# EAGLE design Keyglove Kit v0.1 (EAGLE 6.1)
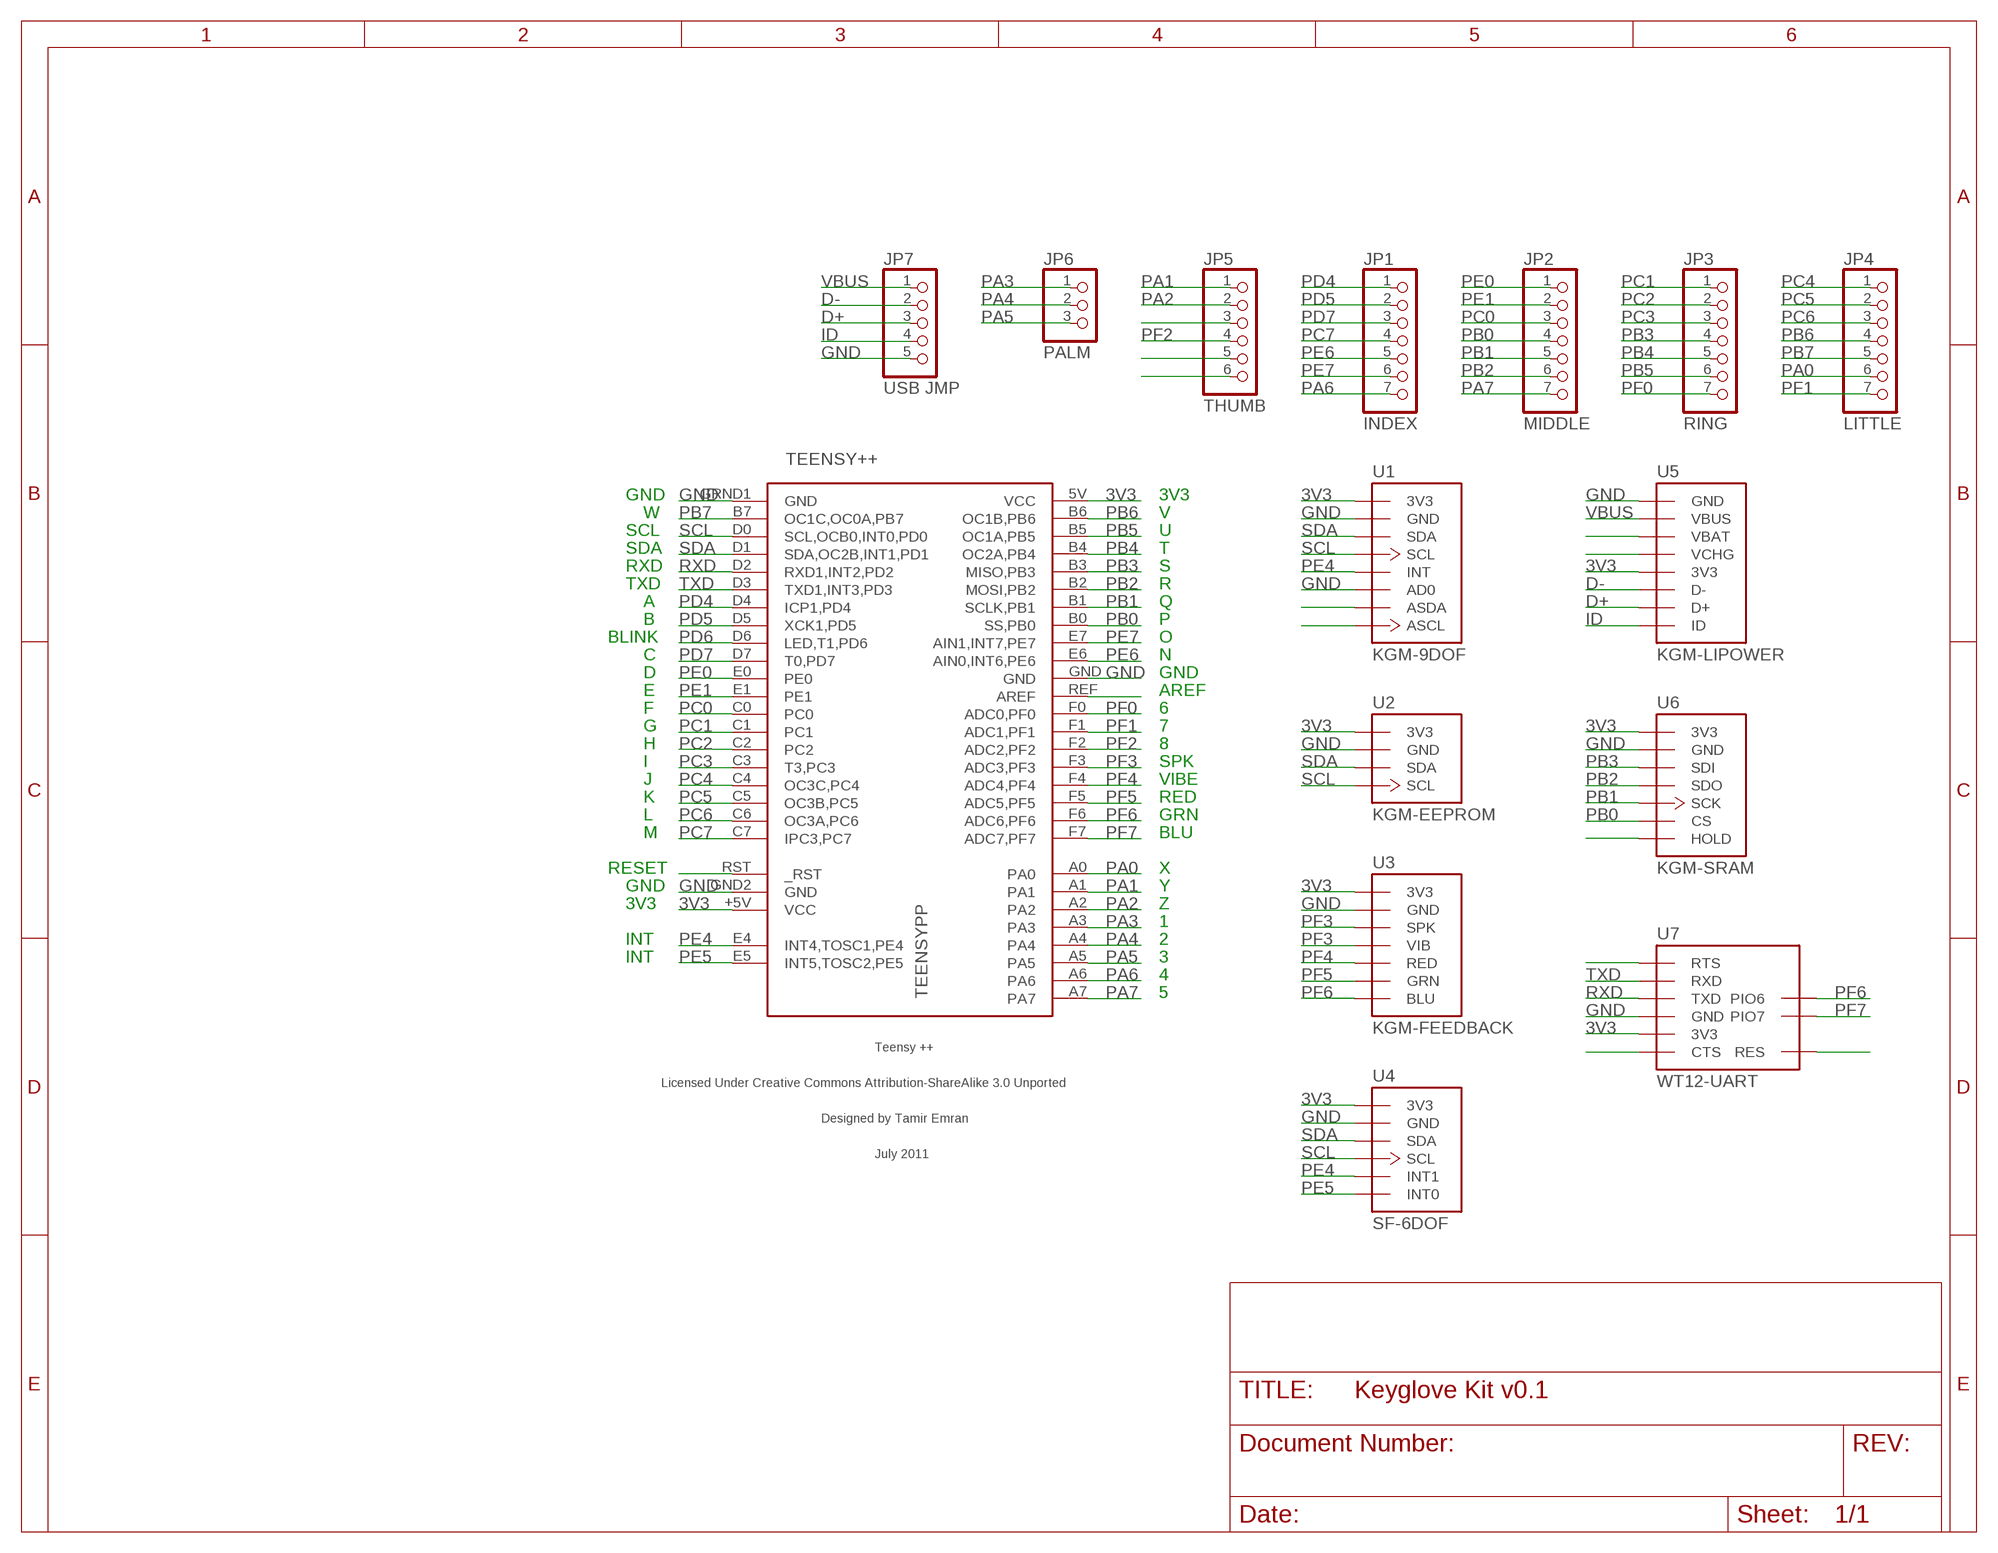
[diagram p0: schematic, sheet 1]

## Parts
JP1  INDEX  PINHD-1X7  [1X07]
JP2  MIDDLE  PINHD-1X7  [1X07]
JP3  RING  PINHD-1X7  [1X07]
JP4  LITTLE  PINHD-1X7  [1X07]
JP5  THUMB  PINHD-1X6  [1X06]
JP6  PALM  PINHD-1X3  [1X03]
JP7  USB JMP  PINHD-1X5  [1X05]
TEENSY++  TEENSYPP  [TEENSYPP]
U1  KGM-9DOF  [KGM-9DOF]
U2  KGM-EEPROM  [KGM-EEPROM]
U3  KGM-FEEDBACK  [KGM-FEEDBACK]
U4  SF-6DOF  [SF-6DOF]
U5  KGM-LIPOWER  [KGM-LIPOWER]
U6  KGM-SRAM  [KGM-SRAM]
U7  WT12-UART  [WT12-UART]

## Nets
3V3 [power]: TEENSY++.5V(VCC) TEENSY++.+5V(VCC) U1.3V3 U2.3V3 U3.3V3 U4.3V3 U5.3V3 U6.3V3 U7.3V3
D+: JP7.3 U5.D+
D-: JP7.2 U5.D-
GND [power]: JP7.5 TEENSY++.GND TEENSY++.GND2(GND) TEENSY++.GRND1(GND) U1.AD0 U1.GND U2.GND U3.GND U4.GND U5.GND U6.GND U7.GND
ID: JP7.4 U5.ID
N$3: U7.RESET(RES)
N$13: JP5.3
N$15: JP5.5
N$16: JP5.6
N$51: U1.ASDA
N$52: U1.ASCL
N$66: U5.VBAT
N$67: U5.VCHG
N$78: U6.HOLD
N$79: U7.RTS
N$80: U7.CTS
N$107: TEENSY++.RST(_RST)
N$128: TEENSY++.REF(AREF)
PA0: JP4.6 TEENSY++.A0
PA1: JP5.1 TEENSY++.A1
PA2: JP5.2 TEENSY++.A2
PA3: JP6.1 TEENSY++.A3
PA4: JP6.2 TEENSY++.A4
PA5: JP6.3 TEENSY++.A5
PA6: JP1.7 TEENSY++.A6
PA7: JP2.7 TEENSY++.A7
PB0: JP2.4 TEENSY++.B0(SS,PB0) U6.CS
PB1: JP2.5 TEENSY++.B1(SCLK,PB1) U6.SCK
PB2: JP2.6 TEENSY++.B2(MOSI,PB2) U6.SDO
PB3: JP3.4 TEENSY++.B3(MISO,PB3) U6.SDI
PB4: JP3.5 TEENSY++.B4(OC2A,PB4)
PB5: JP3.6 TEENSY++.B5(OC1A,PB5)
PB6: JP4.4 TEENSY++.B6(OC1B,PB6)
PB7: JP4.5 TEENSY++.B7(OC1C,OC0A,PB7)
PC0: JP2.3 TEENSY++.C0
PC1: JP3.1 TEENSY++.C1
PC2: JP3.2 TEENSY++.C2
PC3: JP3.3 TEENSY++.C3(T3,PC3)
PC4: JP4.1 TEENSY++.C4(OC3C,PC4)
PC5: JP4.2 TEENSY++.C5(OC3B,PC5)
PC6: JP4.3 TEENSY++.C6(OC3A,PC6)
PC7: JP1.4 TEENSY++.C7(IPC3,PC7)
PD4: JP1.1 TEENSY++.D4(ICP1,PD4)
PD5: JP1.2 TEENSY++.D5(XCK1,PD5)
PD6: TEENSY++.D6(LED,T1,PD6)
PD7: JP1.3 TEENSY++.D7(T0,PD7)
PE0: JP2.1 TEENSY++.E0
PE1: JP2.2 TEENSY++.E1
PE4: TEENSY++.E4(INT4,TOSC1,PE4) U1.INT U4.INT1
PE5: TEENSY++.E5(INT5,TOSC2,PE5) U4.INT0
PE6: JP1.5 TEENSY++.E6(AIN0,INT6,PE6)
PE7: JP1.6 TEENSY++.E7(AIN1,INT7,PE7)
PF0: JP3.7 TEENSY++.F0(ADC0,PF0)
PF1: JP4.7 TEENSY++.F1(ADC1,PF1)
PF2: JP5.4 TEENSY++.F2(ADC2,PF2)
PF3: TEENSY++.F3(ADC3,PF3) U3.SPK U3.VIB
PF4: TEENSY++.F4(ADC4,PF4) U3.RED
PF5: TEENSY++.F5(ADC5,PF5) U3.GRN
PF6: TEENSY++.F6(ADC6,PF6) U3.BLUE(BLU) U7.PIO6
PF7: TEENSY++.F7(ADC7,PF7) U7.PIO7
RXD: TEENSY++.D2(RXD1,INT2,PD2) U7.TXD
SCL: TEENSY++.D0(SCL,OCB0,INT0,PD0) U1.SCL U2.SCL U4.SCL
SDA: TEENSY++.D1(SDA,OC2B,INT1,PD1) U1.SDA U2.SDA U4.SDA
TXD: TEENSY++.D3(TXD1,INT3,PD3) U7.RXD
VBUS [power]: JP7.1 U5.VBUS

## Notes on the sheet
- GND | 3V3
- W | V
- SCL | U
- SDA | T
- RXD | S
- TXD | R
- A | Q
- B | P
- BLINK | O
- C | N
- D | GND
- E | AREF
- F | 6
- G | 7
- H | 8
- I | SPK
- J | VIBE
- K | RED
- L | GRN
- M | BLU
- RESET | X
- GND | Y
- 3V3 | Z
- 1
- INT | 2
- INT | 3
- 4
- 5

## Library data of the parts
JP1-JP4 = sf-pinhead:PINHD-1X7: PIN HEADER
JP5 = sf-pinhead:PINHD-1X6: PIN HEADER
JP6 = sf-pinhead:PINHD-1X3: PIN HEADER
JP7 = sf-pinhead:PINHD-1X5: PIN HEADER
TEENSY++ = sf-keyglovekit:TEENSYPP: Teensy++ Teensy++ board by PJRC <http://www.pjrc.com/>. Eagle part designed by Tamir Emran, July 2011. Licensed under Create Commons Attribution-ShareAlike 3.0 Unported license (CC-BY-SA-3.0).
U1 = sf-keyglovekit:KGM-9DOF
U2 = sf-keyglovekit:KGM-EEPROM
U3 = sf-keyglovekit:KGM-FEEDBACK
U4 = sf-keyglovekit:SF-6DOF
U5 = sf-keyglovekit:KGM-LIPOWER
U6 = sf-keyglovekit:KGM-SRAM
U7 = sf-keyglovekit:WT12-UART

## Net classes
0 default: width 0.152 mm, drill 0.33 mm, clearance 0.152 mm
1 power: width 0.203 mm, drill 0.33 mm, clearance 0.152 mm

## Board
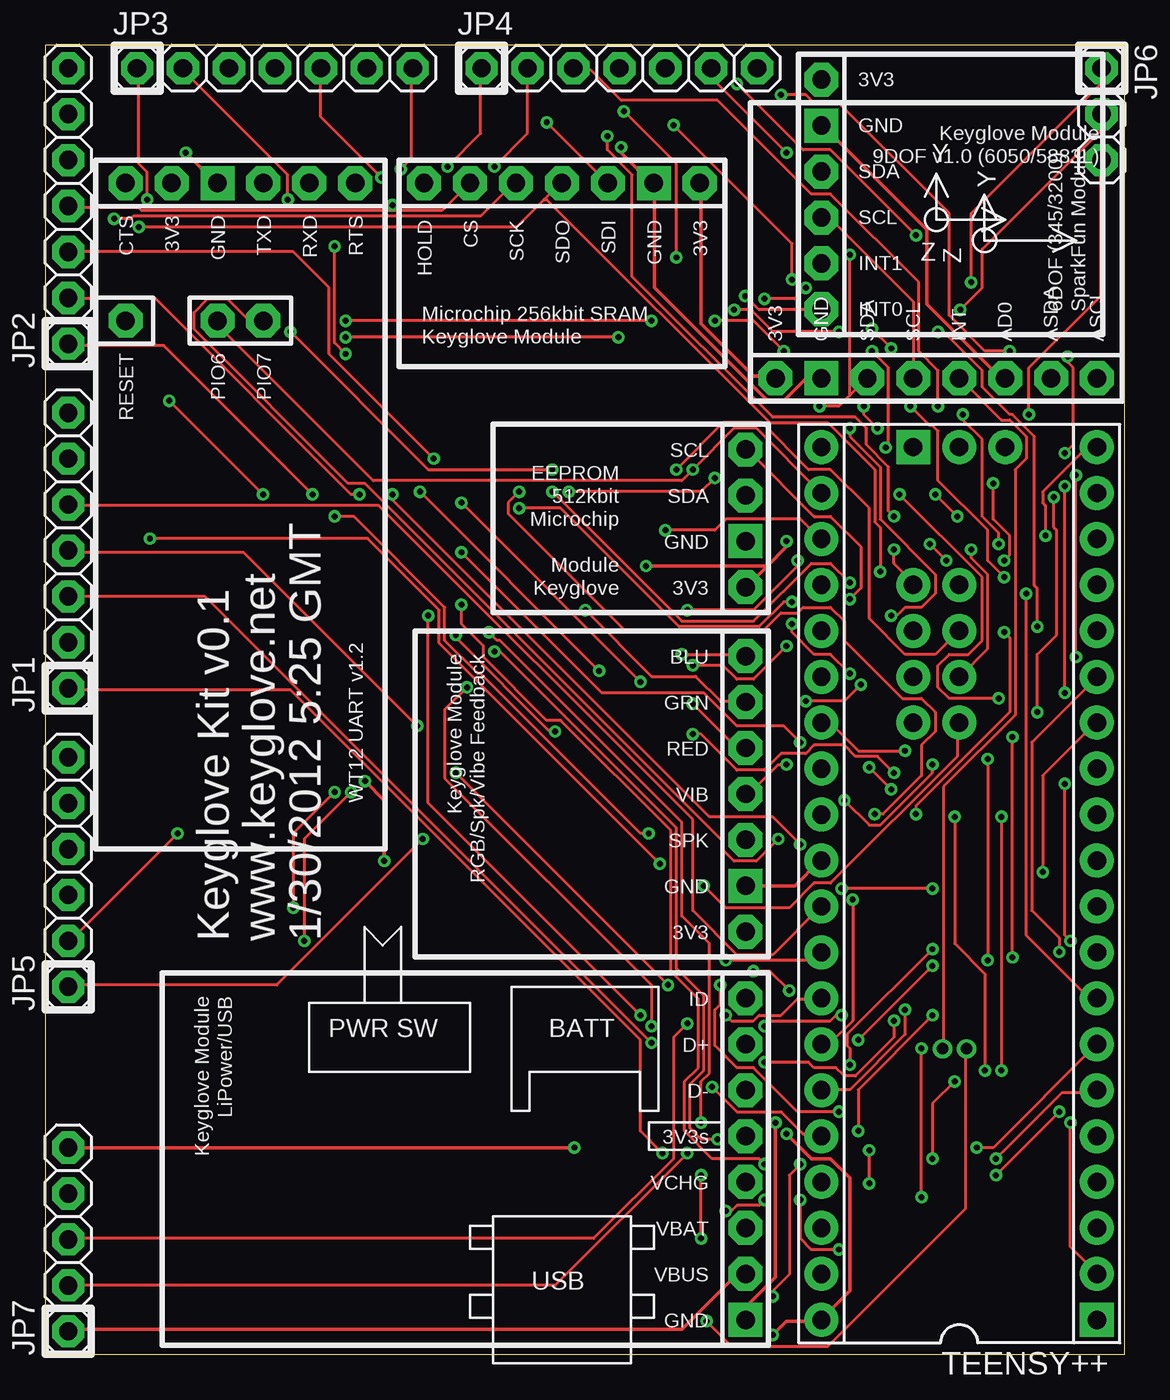
[diagram p1: board, top side]
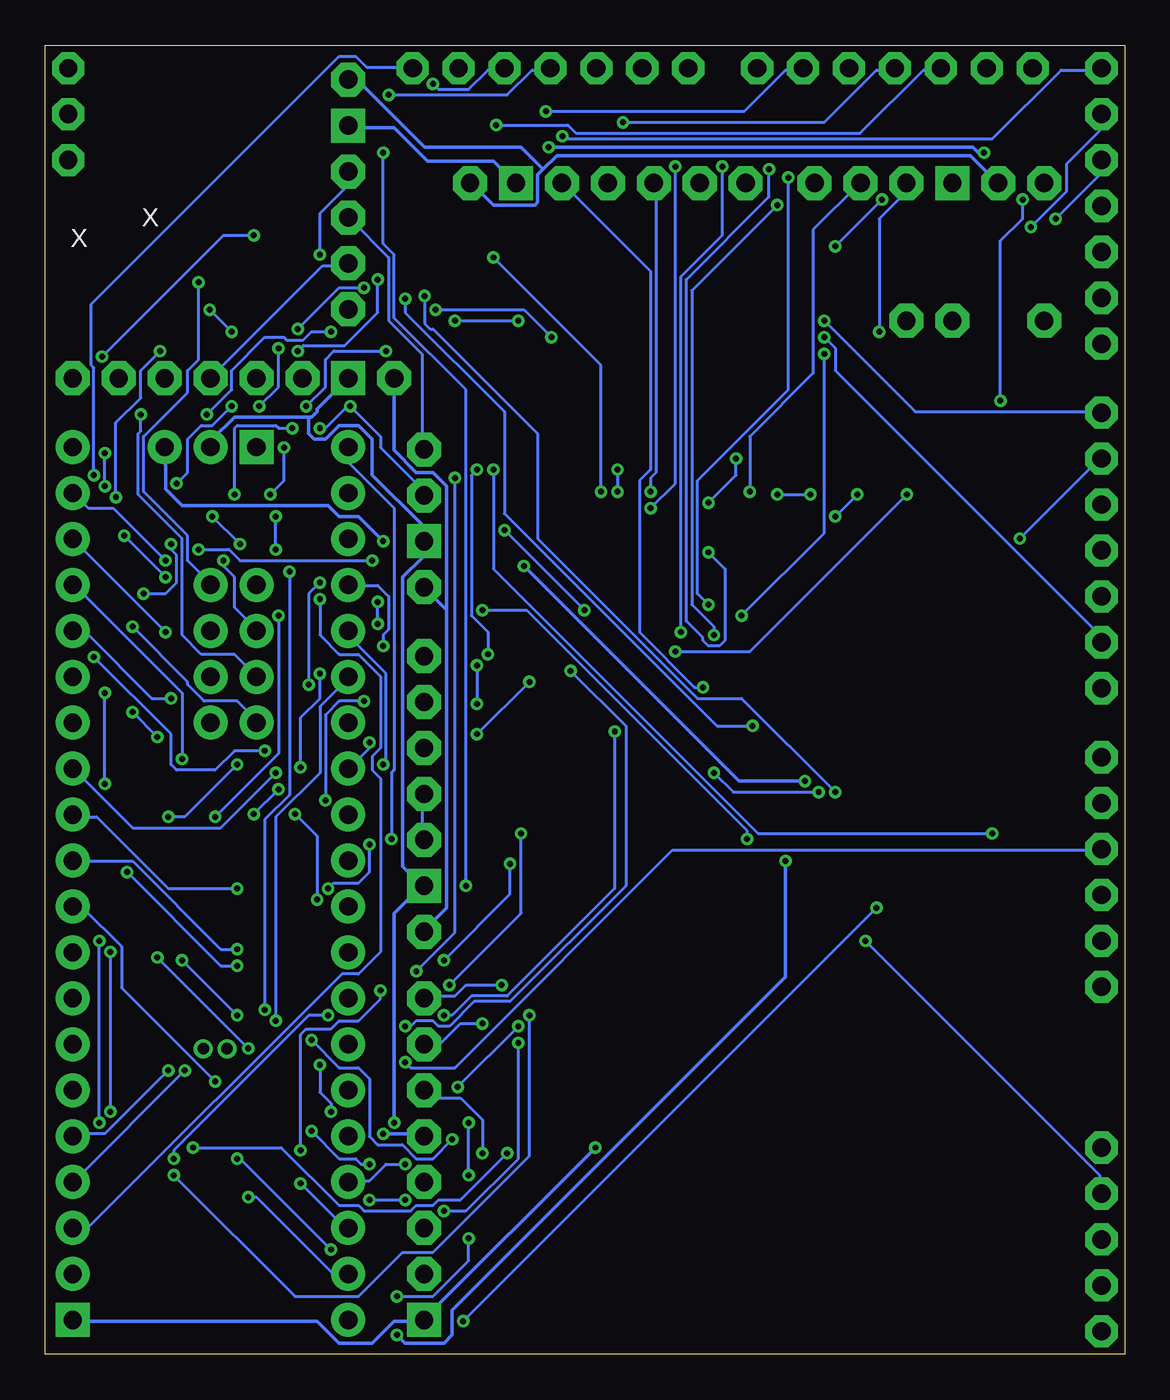
[diagram p2: board, bottom side, seen from below]

Size 59.69 x 72.39 mm. Coordinates in mm from the lower left corner, seen from the top.
Outline: 0,0 59.69,0 59.69,72.39 0,72.39 0,0
Copper layers (1*16): Top 0.0356mm / dielectric 1.5011mm / Bottom 0.0356mm
Design rules: minimum track width 6mil, minimum drill 13mil, track to track 6mil, track to pad 6mil, pad to pad 6mil, via to via 6mil, smd to smd 6mil, copper to edge 15mil, drill to drill 6mil, minimum pad ring 7mil, minimum via ring 7mil, stop-mask expansion 4mil, vias tented up to drill 20mil, thermal gap 10mil

### Footprints (pad centres in the part's own frame; a part is rotated, then mirrored left to right if it is on the bottom)
1X07 = drill 1.016 pad 1.778 octagon: 1 -7.62,0; 2 -5.08,0; 3 -2.54,0; 4 0,0; 5 2.54,0; 6 5.08,0; 7 7.62,0
1X06 = drill 1.016 pad 1.778 octagon: 1 -6.35,0; 2 -3.81,0; 3 -1.27,0; 4 1.27,0; 5 3.81,0; 6 6.35,0
1X03 = drill 1.016 pad 1.778 octagon: 1 -2.54,0; 2 0,0; 3 2.54,0
1X05 = drill 1.016 pad 1.778 octagon: 1 -5.08,0; 2 -2.54,0; 3 0,0; 4 2.54,0; 5 5.08,0
TEENSYPP = drill 1.016 pad 1.88: 5V 24.13,-2.54; +5V -24.13,7.62; A0 8.89,0; A1 11.43,0; A2 13.97,0; A3 16.51,0; A4 8.89,2.54; A5 11.43,2.54; A6 13.97,2.54; A7 16.51,2.54; B0 -6.35,7.62; B1 -8.89,7.62; B2 -11.43,7.62; B3 -13.97,7.62; B4 -16.51,7.62; B5 -19.05,7.62; B6 -21.59,7.62; B7 -21.59,-7.62; C0 6.35,-7.62; C1 8.89,-7.62; C2 11.43,-7.62; C3 13.97,-7.62; C4 16.51,-7.62; C5 19.05,-7.62; C6 21.59,-7.62; C7 24.13,-7.62; D0 -19.05,-7.62; D1 -16.51,-7.62; D2 -13.97,-7.62; D3 -11.43,-7.62; D4 -8.89,-7.62; D5 -6.35,-7.62; D6 -3.81,-7.62; D7 -1.27,-7.62; E0 1.27,-7.62; E1 3.81,-7.62; E6 -1.27,7.62; E7 -3.81,7.62; F0 6.35,7.62; F1 8.89,7.62; F2 11.43,7.62; F3 13.97,7.62; F4 16.51,7.62; F5 19.05,7.62; F6 21.59,7.62; F7 24.13,7.62; GND2 24.13,0; GRND1 1.27,7.62; REF 3.81,7.62 | drill 0.635 pad 1.067: E4 -9.144,0.914; E5 -9.144,-0.406 | drill 1.016 pad 1.88 square: GND -24.13,-7.62; RST 24.13,2.54
KGM-9DOF = drill 1.016 pad 1.88 octagon: 3V3 1.27,19.177; AD0 1.27,6.477; ASCL 1.27,1.397; ASDA 1.27,3.937; INT 1.27,9.017; SCL 1.27,11.557; SDA 1.27,14.097 | drill 1.016 pad 1.88 square: GND 1.27,16.637
KGM-EEPROM = drill 1.016 pad 1.88 octagon: 3V3 1.27,9.017; SCL 1.27,1.397; SDA 1.27,3.937 | drill 1.016 pad 1.88 square: GND 1.27,6.477
KGM-FEEDBACK = drill 1.016 pad 1.88 octagon: 3V3 1.27,16.637; BLUE 1.27,1.397; GRN 1.27,3.937; RED 1.27,6.477; SPK 1.27,11.557; VIB 1.27,9.017 | drill 1.016 pad 1.88 square: GND 1.27,14.097
SF-6DOF = drill 1.016 pad 1.88 octagon: 3V3 1.27,14.097; INT0 1.27,1.397; INT1 1.27,3.937; SCL 1.27,6.477; SDA 1.27,9.017 | drill 1.016 pad 1.88 square: GND 1.27,11.557
KGM-LIPOWER = drill 1.016 pad 1.88 octagon: 3V3 1.27,9.017; D+ 1.27,3.937; D- 1.27,6.477; ID 1.27,1.397; VBAT 1.27,14.097; VBUS 1.27,16.637; VCHG 1.27,11.557 | drill 1.016 pad 1.88 square: GND 1.27,19.177
KGM-SRAM = drill 1.016 pad 1.88 octagon: 3V3 1.27,16.637; CS 1.27,3.937; HOLD 1.27,1.397; SCK 1.27,6.477; SDI 1.27,11.557; SDO 1.27,9.017 | drill 1.016 pad 1.88 square: GND 1.27,14.097
WT12-UART = drill 1.016 pad 1.88 octagon: 3V3 1.27,4.191; CTS 1.27,1.651; PIO6 8.89,6.731; PIO7 8.89,9.271; RESET 8.89,1.651; RTS 1.27,14.351; RXD 1.27,11.811; TXD 1.27,9.271 | drill 1.016 pad 1.88 square: GND 1.27,6.731

### Placement (x,y rotation side)
JP1  1.27,44.45 90 top
JP2  1.27,63.5 90 top
JP3  12.7,71.12 0 top
JP4  31.75,71.12 0 top
JP5  1.27,26.67 90 top
JP6  58.42,68.58 270 top
JP7  1.27,6.35 90 top
TEENSY++  50.55,26.04 90 top
U1  59.56,52.7 90 top
U2  40.01,51.44 180 top
U3  40.01,40.01 180 top
U4  41.66,56.39 0 top
U5  40.01,21.08 180 top
U6  19.56,66.04 270 top
U7  2.79,66.04 270 top

### Tracks (layer width: path | path; a pad name or v marks a point on that pad's centre or on a via)
3V3  (via drill 0.33)
  Top 0.203: U1.3V3 40.39,54.1 39.17,54.1 36.27,57 36.27,64.77 U6.3V3 | v41,12.19 42.37,10.82 43.43,10.82 44.5,9.75 44.5,3.5 42.98,1.98 TEENSY++.+5V 42.82,1.83 41,1.83 v40.23,1.07 | v41,44.96 41,44.65 39.93,43.59 | 39.93,43.59 38.86,42.52 U2.3V3 | v18.75,27.28 18.75,30.63 v17.68,31.7 | 39.93,43.59 v33.22,43.59
  Bottom 0.203: 32.16,65.53 32.46,65.23 32.46,63.7 32.61,63.55 34.9,63.55 36.12,64.77 U6.3V3 | 32.16,65.53 31.39,66.29 8.53,66.29 7.01,64.77 U7.3V3 | 32.16,65.53 33.38,66.75 38.71,66.75 42.37,70.41 42.82,70.41 U4.3V3 | v41,12.19 38.86,12.19 U5.3V3 | 37.49,41.15 37.49,24.69 38.71,23.47 U3.3V3 | 37.49,41.15 38.71,42.37 U2.3V3 | v41,44.96 42.37,46.33 43.43,46.33 44.04,46.94 52.12,46.94 53.03,47.85 53.03,50.14 TEENSY++.5V | v40.23,1.07 39.78,0.61 37.64,0.61 37.19,1.07 37.19,2.44 18.75,20.88 v18.75,27.28 | v17.68,31.7 21.34,31.7 v33.22,43.59 | U1.3V3 40.39,49.99 39.17,48.77 38.25,48.77 37.49,48.01 37.49,41.15
D+  (via drill 0.33)
  Top 0.152: v35.51,18.29 34.75,17.53 34.75,10.82 30.33,6.4 1.37,6.4 JP7.3
  Bottom 0.152: v35.51,18.29 36.73,18.29 37.8,17.22 38.71,17.22 U5.D+
D-  (via drill 0.33)
  Top 0.152: JP7.2 28.19,3.81 v35.51,11.12
  Bottom 0.152: v35.51,11.12 35.51,12.95 36.73,14.17 38.41,14.17 38.71,14.48 U5.D-
GND  (via drill 0.33)
  Top 0.203: v29.26,11.43 JP7.5 | U1.AD0 53.03,54.1 52.73,54.1 48.77,58.06 48.77,62.18 42.98,67.97 U4.GND | U3.GND 41.45,25.91 42.82,27.28 TEENSY++.GRND1 | v7.77,66.45 9.45,64.77 U7.GND | v31.85,66.75 31.85,66.45 33.53,64.77 U6.GND 33.68,64.77 33.68,58.98 39.93,52.73 40.84,52.73 42.06,53.95 42.82,53.95 U1.GND | v40.39,12.8 40.39,4.27 38.86,2.74 38.86,1.98 U5.GND
  Bottom 0.203: v29.26,11.43 38.71,1.98 U5.GND 38.86,1.83 40.39,1.83 41.6,0.61 43.43,0.61 44.65,1.83 58.06,1.83 TEENSY++.GND | 38.86,44.96 38.86,44.04 39.93,42.98 39.93,26.98 38.86,25.91 | 45.11,51.82 49.23,51.82 50.44,50.6 50.44,50.29 TEENSY++.GND2 | 45.11,51.82 44.96,51.82 44.65,52.12 44.65,52.27 42.98,53.95 U1.GND | v7.77,66.45 8.08,66.45 8.38,66.75 v31.85,66.75 | 38.86,44.96 38.86,45.87 41.6,48.62 41.6,50.6 42.37,51.36 43.43,51.36 44.2,50.6 44.81,50.6 45.11,50.9 45.11,51.82 | 38.86,44.96 U2.GND | U4.GND 42.82,67.82 40.39,67.82 38.56,65.99 34.9,65.99 33.68,64.77 U6.GND | v40.39,12.8 40.39,24.38 38.86,25.91 | 38.86,25.91 U3.GND
ID  (via drill 0.33)
  Top 0.152: v14.33,22.86 14.33,28.5 v16.92,31.09 | v34.44,20.42 v22.71,32.16
  Bottom 0.152: v14.33,22.86 1.37,9.91 1.37,8.99 JP7.4 | v16.92,31.09 21.64,31.09 v22.71,32.16 | v34.44,20.42 36.42,20.42 37.03,19.81 38.71,19.81 U5.ID
PA0  (via drill 0.33)
  Top 0.152: v41,66.45 36.88,70.56 36.88,71.02 JP4.6 | v36.42,25.91 37.64,24.69 41.15,24.69 42.52,26.06 43.43,26.06 50.44,33.07 50.44,34.9 TEENSY++.A0
  Bottom 0.152: v41,66.45 41,61.42 40.39,60.81 40.39,57.3 36.42,53.34 v36.42,25.91
PA1  (via drill 0.33)
  Top 0.152: v20.88,28.5 12.8,20.42 1.37,20.42 JP5.1 | v35.51,41.15 39.17,41.15 41.6,43.59 v41.6,43.89 | v51.21,44.5 51.21,44.04 52.12,43.13 52.12,39.01 50.6,37.49 TEENSY++.A1
  Bottom 0.152: v20.88,28.5 20.88,28.96 33.07,41.15 v35.51,41.15 | v41.6,43.89 48.92,43.89 49.53,44.5 v51.21,44.5
PA2  (via drill 0.33)
  Top 0.152: v7.32,28.8 1.37,22.86 JP5.2 | v34.9,48.92 37.49,51.51 39.62,51.51 42.22,48.92 43.43,48.92 45.57,46.79 45.57,40.69 47.55,38.71 49.23,38.71 50.44,39.93 TEENSY++.A2
  Bottom 0.152: v7.32,28.8 20.27,28.8 34.9,43.43 v34.9,48.92
PA3  (via drill 0.33)
  Top 0.152: v51.21,59.28 51.21,63.09 58.37,70.26 58.37,71.02 JP6.1
  Bottom 0.152: v51.21,59.28 51.21,55.02 51.82,54.41 51.82,53.19 54.25,50.75 54.25,47.7 51.82,45.26 51.82,43.89 50.6,42.67 TEENSY++.A3
PA4  (via drill 0.33)
  Top 0.152: v50.6,57.76 51.82,58.98 51.82,61.11 58.37,67.67 58.37,68.58 JP6.2 | v49.38,56.54 49.68,56.54 51.82,54.41 51.82,53.49 53.34,51.97 53.49,51.97 54.71,50.75 54.71,42.52 54.86,42.37 v54.86,40.23
  Bottom 0.152: v49.38,56.54 v50.6,57.76 | v54.86,40.23 51.82,37.19 51.82,37.03 50.9,36.12 49.07,36.12 48.01,35.05 TEENSY++.A4
PA5  (via drill 0.33)
  Top 0.152: v54.41,51.97 54.41,54.56 58.37,58.52 58.37,65.99 JP6.3
  Bottom 0.152: v54.41,51.97 54.41,51.05 54.56,50.9 54.56,47.55 52.12,45.11 52.12,39.78 51.05,38.71 49.23,38.71 48.01,37.49 TEENSY++.A5
PA6  (via drill 0.33)
  Top 0.152: v33.53,57.15 v16.61,57.15 | v37.03,57.15 39.17,57.15 v40.84,55.47 | v45.26,52.43 45.26,51.97 v46.02,51.21 | v50.44,46.33 v49.23,47.55 | v49.84,43.89 v48.92,44.81
  Bottom 0.152: v16.61,57.15 11.58,52.12 1.37,52.12 JP1.7 | v37.03,57.15 v33.53,57.15 | v40.84,55.47 43.74,55.47 44.2,55.02 44.2,53.49 v45.26,52.43 | v46.02,51.21 46.79,51.21 46.94,51.36 49.07,51.36 49.23,51.21 v49.23,47.55 | v48.92,44.81 v50.44,46.33 | v49.84,43.89 49.84,43.59 49.23,42.98 49.23,41.3 48.01,40.08 TEENSY++.A6
PA7  (via drill 0.33)
  Top 0.152: v31.09,67.36 31.09,66.6 32.46,65.23 32.46,59.59 40.23,51.82 44.81,51.82 45.41,51.21 45.41,50.29 46.63,49.07 46.63,46.63 v46.94,46.33 | v46.94,44.5 46.94,43.74 48.01,42.67 TEENSY++.A7
  Bottom 0.152: v31.09,67.36 30.94,67.21 7.32,67.21 3.5,71.02 1.37,71.02 JP2.7 | v46.94,44.5 v46.94,46.33
PB0  (via drill 0.33)
  Top 0.152: 19.2,63.25 21.95,63.25 23.47,64.77 U6.CS | 19.2,63.25 5.33,63.25 5.18,63.4 1.37,63.4 JP2.4 | v37.64,18.75 37.95,18.44 39.17,18.44 39.47,18.75 40.69,18.75 41.6,19.66 42.82,19.66 TEENSY++.B0 | v28.19,34.44 27.89,34.44 22.71,39.62 v22.71,39.78 | 19.2,63.25 v19.2,63.55
  Bottom 0.152: v37.64,18.75 37.19,18.75 36.12,19.81 34.14,19.81 28.19,25.76 v28.19,34.44 | v22.71,39.78 22.71,40.23 23.93,41.45 23.93,58.83 v19.2,63.55
PB1  (via drill 0.33)
  Top 0.152: v3.81,62.79 4.72,62.79 4.88,62.94 24.08,62.94 25.91,64.77 U6.SCK | v44.65,25.15 44.65,18.44 43.43,17.22 42.98,17.22 TEENSY++.B1 | v45.87,29.87 46.33,29.87 48.46,32 48.46,33.68 49.23,34.44 49.23,35.51 48.46,36.27 47.4,36.27 44.2,39.47 44.2,40.54 43.43,41.3 41.91,41.3 41.6,41 40.69,41 39.62,39.93 32.16,39.93 25.6,46.48 25.6,47.09 v26.21,47.7
  Bottom 0.152: v3.81,62.79 1.37,65.23 1.37,65.99 JP2.5 | v44.65,25.15 44.65,28.65 v45.87,29.87 | v26.21,47.7 26.21,48.46 25.91,48.77 25.91,64.77 U6.SCK
PB2  (via drill 0.33)
  Top 0.152: v5.18,62.33 26.06,62.33 27.58,63.86 | 27.58,63.86 28.5,64.77 U6.SDO | v47.55,19.05 47.55,17.68 44.5,14.63 42.98,14.63 TEENSY++.B2 | v46.18,43.28 46.18,45.72 45.87,46.02 45.87,48.92 43.28,51.51 40.08,51.51 27.74,63.86 27.58,63.86
  Bottom 0.152: v5.18,62.33 3.2,64.31 3.2,65.84 1.37,67.67 1.37,68.58 JP2.6 | v47.55,19.05 47.55,29.57 46.18,30.94 v46.18,43.28
PB3  (via drill 0.33)
  Top 0.152: v27.74,68.12 31.09,64.77 U6.SDI | v36.88,14.78 38.25,13.41 40.69,13.41 41.91,12.19 42.82,12.19 TEENSY++.B3 | v33.53,18.14 33.53,20.42 22.1,31.85 22.1,35.66 v23.32,36.88
  Bottom 0.152: v27.74,68.12 16.61,68.12 13.72,71.02 12.8,71.02 JP3.4 | v33.53,18.14 v36.88,14.78 | v23.32,36.88 23.77,36.88 26.82,39.93 26.82,48.31 26.21,48.92 26.21,59.89 31.09,64.77 U6.SDI
PB4  (via drill 0.33)
  Top 0.152: JP3.5 15.24,68.43 v18.59,65.08 | v23.01,41.45 23.01,40.39 24.23,39.17 24.23,38.56 27.74,35.05 28.5,35.05 34.59,28.96 34.59,21.18 36.12,19.66 36.12,15.85 35.36,15.09 35.36,12.34 36.88,10.82 39.47,10.82 v39.78,10.52
  Bottom 0.152: v18.59,65.08 18.59,53.34 23.62,48.31 23.62,42.06 v23.01,41.45 | v39.78,10.52 40.84,10.52 41.76,9.6 42.82,9.6 TEENSY++.B4
PB5  (via drill 0.33)
  Top 0.152: v32,68.73 34.9,65.84 v34.9,60.66 | v28.96,47.7 36.27,47.7 v37.03,48.46 | v39.17,21.18 40.08,21.18 v41.15,20.12 | v45.57,9.45 v45.57,11.28
  Bottom 0.152: v32,68.73 21.03,68.73 18.75,71.02 17.83,71.02 JP3.6 | v34.9,60.66 28.96,54.71 v28.96,47.7 | v37.03,48.46 37.03,23.32 v39.17,21.18 | v41.15,20.12 41.15,19.66 42.37,18.44 43.43,18.44 43.89,17.98 45.26,17.98 45.57,17.68 v45.57,11.28 | v45.57,9.45 42.98,6.86 TEENSY++.B5
PB6  (via drill 0.33)
  Top 0.152: v40.69,69.65 42.06,69.65 42.52,69.19 43.89,69.19 49.99,63.09 49.99,57.45 51.97,55.47 v53.34,55.47 | v55.78,47.4 55.78,45.72 55.93,45.57 55.93,39.78 54.86,38.71 v54.86,35.51 | v53.49,21.95 v53.49,34.14 | v48.46,8.69 v48.46,16.92
  Bottom 0.152: v40.69,69.65 34.14,69.65 32.77,71.02 31.85,71.02 JP4.4 | v53.34,55.47 54.41,54.41 54.41,52.88 55.78,51.51 v55.78,47.4 | v53.49,34.14 v54.86,35.51 | v48.46,16.92 v53.49,21.95 | v48.46,8.69 48.01,8.69 43.89,4.57 42.98,4.57 TEENSY++.B6
PB7  (via drill 0.33)
  Top 0.152: v38.25,70.26 41.91,66.6 43.43,66.6 v48.16,61.87 | v56.54,55.17 56.54,54.86 56.84,54.56 56.84,50.29 v56.39,49.84 | v56.39,36.58 v56.39,48.01 | v56.39,31.55 56.39,23.16 v56.69,22.86 | v56.69,12.8 56.69,5.94 58.06,4.57 TEENSY++.B7
  Bottom 0.152: v38.25,70.26 37.95,69.95 36.27,69.95 35.2,71.02 34.29,71.02 JP4.5 | v48.16,61.87 49.84,61.87 v56.54,55.17 | v56.39,48.01 v56.39,49.84 | v56.39,31.55 v56.39,36.58 | v56.69,12.8 v56.69,22.86
PC0  (via drill 0.33)
  Top 0.152: JP2.3 13.72,60.96 15.7,58.98 15.7,55.32 v21.49,49.53 | v32.92,37.19 v23.01,47.09 | v35.81,34.29 36.27,34.29 38.25,32.31 39.78,32.31 40.69,33.22 42.06,33.22 42.52,33.68 44.2,33.68 44.81,33.07 46.02,33.07 v46.94,32.16
  Bottom 0.152: v21.49,49.53 21.49,48.62 v23.01,47.09 | v35.81,34.29 v32.92,37.19 | v46.94,32.16 49.99,29.11 54.86,29.11 58.06,32.31 TEENSY++.C0
PC1  (via drill 0.33)
  Top 0.152: v5.64,63.86 5.64,65.38 5.18,65.84 5.18,71.02 JP3.1 | v12.04,47.55 v6.86,52.73 | v24.84,38.86 25.15,38.86 34.9,29.11 34.9,21.34 36.42,19.81 36.42,15.7 35.66,14.94 35.66,12.5 36.27,11.89 v37.19,11.89 | v49.07,21.49 v44.96,17.37 | v55.17,26.67 55.17,32 58.06,34.9 TEENSY++.C1
  Bottom 0.152: v5.64,63.86 5.64,62.79 6.86,61.57 v6.86,52.73 | v12.04,47.55 20.73,38.86 v24.84,38.86 | v37.19,11.89 38.25,10.82 39.17,10.82 39.93,11.58 41.3,11.58 41.76,12.04 41.76,15.24 42.37,15.85 43.43,15.85 v44.96,17.37 | v49.07,21.49 49.99,21.49 v55.17,26.67
PC2  (via drill 0.33)
  Top 0.152: v13.41,63.86 13.41,65.23 7.62,71.02 JP3.2 | v16,61.27 16,55.93 v16.61,55.32 | v21.18,40.84 21.18,30.48 v32.92,18.75 | v56.08,13.41 v52.58,9.91 | v56.08,22.25 56.08,23.01 54.56,24.54 54.56,33.83 58.06,37.34 TEENSY++.C2
  Bottom 0.152: v16,61.27 v13.41,63.86 | v16.61,55.32 16.61,45.41 v21.18,40.84 | v32.92,18.75 32.92,10.97 38.25,5.64 39.93,5.64 42.37,3.2 45.87,3.2 v52.58,9.91 | v56.08,22.25 v56.08,13.41
PC3  (via drill 0.33)
  Top 0.152: v34.75,67.97 41.3,61.42 v41.3,59.44 | v45.72,55.47 46.63,54.56 46.63,50.29 v46.48,50.14 | v47.24,47.55 51.82,42.98 51.82,39.47 51.05,38.71 49.99,38.71 49.38,38.1 49.38,36.88 49.99,36.27 v52.73,36.27
  Bottom 0.152: v34.75,67.97 30.79,67.97 30.33,67.51 14.63,67.51 11.12,71.02 10.21,71.02 JP3.3 | v41.3,59.44 41.3,57.61 43.13,55.78 45.41,55.78 v45.72,55.47 | v46.48,50.14 46.48,48.31 v47.24,47.55 | v52.73,36.27 53.8,36.27 57.45,39.93 58.06,39.93 TEENSY++.C3
PC4  (via drill 0.33)
  Top 0.152: v22.25,65.68 24.08,67.51 24.08,71.02 JP4.1 | v24.54,39.93 24.99,39.47 25.15,39.47 35.2,29.41 35.2,24.23 36.73,22.71 36.73,15.54 36.27,15.09 v36.27,12.8 | v36.27,6.4 v36.27,9.91 | v40.23,3.2 40.23,3.5 41.15,4.42 41.15,9.91 v41.76,10.52 | v44.96,12.34 44.96,14.63 v49.07,18.75 | v52.12,32.92 v52.12,21.79
  Bottom 0.152: v22.25,65.68 22.25,61.87 24.54,59.59 v24.54,39.93 | v36.27,9.91 v36.27,12.8 | v36.27,6.4 36.27,5.18 38.25,3.2 v40.23,3.2 | v41.76,10.52 42.22,10.52 42.52,10.82 43.43,10.82 v44.96,12.34 | v52.12,21.79 v49.07,18.75 | v52.12,32.92 52.12,36.58 58.06,42.52 TEENSY++.C4
PC5  (via drill 0.33)
  Top 0.152: JP4.2 26.67,67.51 v24.84,65.68 | v26.21,46.79 28.5,46.79 35.05,40.23 39.47,40.23 40.84,41.6 v41.3,41.6 | v41.3,40.39 41.3,39.93 42.52,38.71 43.43,38.71 v44.5,37.64 | v46.79,31.24 v45.57,32.46 | v48.16,29.87 48.16,30.33 53.34,35.51 53.34,39.62 v53.03,39.93
  Bottom 0.152: v24.84,65.68 24.84,48.16 v26.21,46.79 | v41.3,40.39 v41.3,41.6 | v44.5,37.64 44.5,36.27 45.57,35.2 v45.57,32.46 | v48.16,29.87 v46.79,31.24 | v53.03,39.93 58.06,44.96 TEENSY++.C5
PC6  (via drill 0.33)
  Top 0.152: v49.38,52.43 49.38,54.41 48.31,55.47 48.31,59.28 43.43,64.16 42.37,64.16 37.19,69.34 31.85,69.34 30.18,71.02 29.26,71.02 JP4.3 | v52.43,48.16 52.43,46.18 53.34,45.26 53.34,44.2 v53.03,43.89
  Bottom 0.152: v49.38,52.43 50.44,51.36 51.05,51.36 51.82,50.6 51.82,48.77 v52.43,48.16 | v53.03,43.89 55.93,46.79 57.3,46.79 58.06,47.55 TEENSY++.C6
PC7  (via drill 0.33)
  Top 0.152: v20.57,34.75 10.97,44.35 1.37,44.35 JP1.4 | v39.78,58.37 41.45,58.37 v42.06,58.98 | v46.79,55.63 v45.72,56.69 | v47.85,52.43 48.92,51.36 49.07,51.36 49.38,51.05 49.38,48.31 52.12,45.57 52.12,43.89 v53.03,42.98 | v55.32,45.26 55.32,46.94 55.17,47.09 55.17,47.7 57.61,50.14 58.06,50.14 TEENSY++.C7
  Bottom 0.152: v20.57,34.75 22.55,34.75 34.29,46.48 34.29,52.12 39.78,57.61 v39.78,58.37 | v42.06,58.98 43.43,58.98 v45.72,56.69 | v46.79,55.63 46.79,53.49 v47.85,52.43 | v55.32,45.26 v53.03,42.98
PD4  (via drill 0.33)
  Top 0.152: v34.14,11.12 32.92,12.34 32.92,17.37 13.56,36.73 1.37,36.73 JP1.1 | v51.51,11.43 52.43,11.43 58.06,17.07 TEENSY++.D4
  Bottom 0.152: v34.14,11.12 36.73,8.53 37.95,8.53 38.25,8.23 39.17,8.23 39.47,7.92 42.06,7.92 42.37,8.23 43.43,8.23 46.63,11.43 v51.51,11.43
PD5  (via drill 0.33)
  Top 0.152: v31.7,56.24 v16.61,56.24 | v38.1,57.76 39.01,57.76 40.23,56.54 v43.89,56.54 | v50.75,51.97 50.75,51.66 51.82,50.6 51.82,46.33 52.73,45.41 v52.73,44.81 | v54.25,42.06 54.25,23.16 57.61,19.81 58.06,19.81 TEENSY++.D5
  Bottom 0.152: v16.61,56.24 16,55.63 16,54.41 1.37,39.78 1.37,39.47 JP1.2 | v31.7,56.24 33.22,57.76 v38.1,57.76 | v43.89,56.54 44.96,56.54 45.41,56.08 46.33,56.08 46.48,56.24 47.55,56.24 49.38,54.41 49.38,53.34 v50.75,51.97 | v52.73,44.81 52.73,44.5 52.43,44.2 52.43,42.67 53.03,42.06 v54.25,42.06
PD7  (via drill 0.33)
  Top 0.152: JP1.3 8.84,41.91 v33.53,17.22 | v37.64,7.92 37.95,7.92 38.25,8.23 39.47,8.23 v39.78,8.53 | v41.76,8.53 41.76,6.4 42.37,5.79 v43.89,5.79 | v49.07,10.82 49.07,13.87 v50.29,15.09
  Bottom 0.152: v33.53,17.22 33.53,10.82 36.42,7.92 v37.64,7.92 | v41.76,8.53 v39.78,8.53 | v43.89,5.79 48.92,10.82 v49.07,10.82 | v50.29,15.09 55.47,20.27 55.47,22.55 57.61,24.69 58.06,24.69 TEENSY++.D7
PE0  (via drill 0.33)
  Top 0.152: v14.78,47.55 6.55,55.78 1.37,55.78 JP2.1 | v16,46.33 17.07,46.33 22.1,41.3 22.1,39.47 23.93,37.64 24.08,37.64 32.92,28.8 v33.38,28.8 | v37.34,20.42 37.34,19.36 37.03,19.05 37.03,17.07 38.25,15.85 39.17,15.85 41.6,13.41 v43.89,13.41 | v44.5,16 44.5,16.92 44.35,17.07 44.35,17.68 v49.07,22.4
  Bottom 0.152: v16,46.33 v14.78,47.55 | v33.38,28.8 33.38,24.38 v37.34,20.42 | v43.89,13.41 43.89,13.87 44.5,14.48 v44.5,16 | v49.07,22.4 49.99,22.4 54.86,27.28 58.06,27.28 TEENSY++.E0
PE1  (via drill 0.33)
  Top 0.152: v17.37,47.55 16.92,47.55 6.1,58.37 1.37,58.37 JP2.2 | v19.2,47.55 19.2,47.24 36.73,29.72 40.23,29.72 v41.76,28.19 | v49.07,25.76 v44.04,25.76
  Bottom 0.152: v19.2,47.55 v17.37,47.55 | v41.76,28.19 41.76,26.67 42.37,26.06 43.74,26.06 v44.04,25.76 | v49.07,25.76 52.88,25.76 56.84,29.72 58.06,29.72 TEENSY++.E1
PE4
  Top 0.152: TEENSY++.E4 49.68,16.92 49.68,31.39 53.65,35.36 53.65,48.92 54.25,49.53 54.25,50.75 53.34,51.66 52.88,51.66 50.6,53.95 U1.INT
  Bottom 0.152: U4.INT1 42.98,60.2 44.35,60.2 50.44,54.1 U1.INT
PE5  (via drill 0.33)
  Top 0.152: v36.58,1.83 37.95,0.46 43.28,0.46 50.9,8.08 50.9,16.76 TEENSY++.E5 | v13.72,24.69 13.72,28.8 v16,31.09 | v38.71,58.52 39.47,57.76 42.82,57.76 U4.INT0
  Bottom 0.152: v13.72,24.69 v36.58,1.83 | v16,31.09 21.18,36.27 23.62,36.27 32.46,45.11 32.46,50.9 38.25,56.69 38.41,56.69 38.71,57 v38.71,58.52
PE6
  Top 0.152: JP1.5 1.37,46.94 18.44,46.94 35.81,29.57 35.81,24.54 38.25,22.1 40.23,22.1 42.82,24.69 TEENSY++.E6
PE7  (via drill 0.33)
  Top 0.152: v5.79,45.11 17.83,45.11 21.79,41.15 21.79,39.32 v33.98,27.13 | v37.64,21.79 42.52,21.79 42.82,22.1 TEENSY++.E7
  Bottom 0.152: v5.79,45.11 1.37,49.53 JP1.6 | v33.98,27.13 33.98,25.45 v37.64,21.79
PF0  (via drill 0.33)
  Top 0.152: v19.66,65.53 20.27,66.14 20.27,71.02 JP3.7 | v23.01,44.35 30.79,36.58 36.42,36.58 38.25,34.75 40.84,34.75 v41.76,33.83
  Bottom 0.152: v19.66,65.53 19.66,64.01 24.23,59.44 24.23,40.54 23.32,39.62 23.32,39.47 23.01,39.17 22.4,39.17 22.1,39.47 22.1,43.43 v23.01,44.35 | v41.76,33.83 41.76,33.53 42.82,32.46 TEENSY++.F0
PF1  (via drill 0.33)
  Top 0.152: v57,38.56 v57,48.62 | v47.55,33.38 44.96,33.38 43.43,34.9 42.98,34.9 TEENSY++.F1
  Bottom 0.152: v57,48.62 57,54.56 57.15,54.71 57.15,58.06 43.43,71.78 42.52,71.78 41.91,71.17 39.47,71.17 JP4.7 | v57,38.56 52.73,34.29 52.73,32.61 52.43,32.31 50.29,32.31 49.23,33.38 v47.55,33.38
PF2  (via drill 0.33)
  Top 0.152: v39.78,16.15 42.22,16.15 42.52,15.85 43.74,15.85 44.2,15.39 44.81,15.39 46.94,17.53 v46.94,18.44
  Bottom 0.152: v39.78,16.15 39.47,15.85 37.03,15.85 24.99,27.89 1.37,27.89 JP5.4 | v46.94,18.44 46.94,29.72 44.5,32.16 44.5,35.81 42.98,37.34 TEENSY++.F2
PF3  (via drill 0.33)
  Top 0.152: v41,32.61 40.54,32.61 38.86,30.94 U3.VIB
  Bottom 0.152: U3.SPK 38.86,28.5 38.86,30.94 U3.VIB | v41,32.61 40.84,32.77 40.84,37.64 42.82,39.62 42.82,39.93 TEENSY++.F3
PF4  (via drill 0.33)
  Top 0.152: U3.RED 38.25,33.53 v35.81,35.97 | v35.81,38.1 37.49,38.1 38.25,37.34 39.17,37.34 v41,39.17
  Bottom 0.152: v35.81,38.1 v35.81,35.97 | v41,39.17 41,39.78 40.69,40.08 40.69,41.91 41.3,42.52 42.82,42.52 TEENSY++.F4
PF5  (via drill 0.33)
  Top 0.152: v29.87,41.15 33.53,37.49 35.97,37.49 37.34,36.12 38.71,36.12 U3.GRN | v34.29,45.57 37.03,45.57 37.64,46.18 41.76,46.18 42.82,45.11 TEENSY++.F5
  Bottom 0.152: v34.29,45.57 v29.87,41.15
PF6  (via drill 0.33)
  Top 0.152: v35.2,38.71 38.71,38.71 U3.BLUE | TEENSY++.F6 42.82,47.7 39.32,51.21 38.1,51.21 v35.81,48.92 35.2,48.31 18.14,48.31 9.6,56.84 9.6,57.15 U7.PIO6
  Bottom 0.152: v35.2,38.71 35.2,39.93 36.12,40.84 36.12,48.62 v35.81,48.92
PF7  (via drill 0.33)
  Top 0.152: U7.PIO7 11.28,57.15 10.06,58.37 8.99,58.37 8.23,57.61 8.23,56.69 16.76,48.16 17.68,48.16 37.49,28.35 37.49,27.89 38.1,27.28 39.32,27.28 v40.54,28.5
  Bottom 0.152: v40.54,28.5 40.54,32.16 40.39,32.31 40.39,46.79 42.82,49.23 42.82,50.14 TEENSY++.F7
RXD  (via drill 0.33)
  Top 0.152: v52.88,29.72 v52.88,15.7 | v49.07,32.61 49.07,32.16 46.18,29.26 45.57,29.26 v44.2,30.63 | v42.06,36.12 44.2,36.12 v45.11,37.03 | v44.5,42.67 43.43,43.74 42.37,43.74 39.17,40.54 35.2,40.54 v28.04,47.7 | v28.04,48.92 21.18,48.92 v13.56,56.54
  Bottom 0.152: v52.88,15.7 56.39,12.19 58.06,12.19 TEENSY++.D2 | v52.88,29.72 51.97,29.72 v49.07,32.61 | v44.2,30.63 44.2,35.36 43.43,36.12 v42.06,36.12 | v45.11,37.03 45.11,42.06 v44.5,42.67 | v28.04,48.92 v28.04,47.7 | v13.56,56.54 13.56,62.79 12.19,64.16 12.19,64.77 U7.TXD
SCL  (via drill 0.33)
  Top 0.152: v44.5,41.76 45.11,42.37 45.11,44.65 43.43,46.33 42.52,46.33 38.86,49.99 U2.SCL | U1.SCL 48.01,58.22 43.43,62.79 42.98,62.79 U4.SCL
  Bottom 0.152: U2.SCL 38.86,50.14 38.86,55.32 40.69,57.15 40.69,60.66 42.82,62.79 U4.SCL | v44.5,41.76 44.5,39.78 43.43,38.71 42.37,38.71 41.15,37.49 41.15,33.53 41.6,33.07 41.6,32.31 41.15,31.85 41.15,22.25 42.37,21.03 43.28,21.03 57.3,7.01 58.06,7.01 TEENSY++.D0
SDA  (via drill 0.33)
  Top 0.152: v42.82,52.43 43.89,52.43 44.5,53.03 | 44.5,53.03 45.41,53.95 U1.SDA | v51.97,15.7 51.97,21.03 50.29,22.71 v50.29,29.72 | v46.79,40.84 47.09,40.84 47.55,41.3 48.46,41.3 49.23,42.06 49.23,43.13 46.18,46.18 46.18,49.07 44.5,50.75 v44.5,51.21 | 44.5,53.03 v44.5,60.81
  Bottom 0.152: U2.SDA 38.86,47.55 38.86,47.85 41.15,50.14 41.15,50.75 v42.82,52.43 42.98,52.43 44.2,51.21 v44.5,51.21 | v51.97,15.7 58.06,9.6 TEENSY++.D1 | v50.29,29.72 46.79,33.22 v46.79,40.84 | v44.5,60.81 44.5,63.09 42.98,64.62 42.98,65.38 U4.SDA
TXD  (via drill 0.33)
  Top 0.152: v52.58,10.82 56.24,14.48 58.06,14.48 TEENSY++.D3 | v44.04,18.75 43.74,18.75 43.43,18.44 40.08,18.44 v39.78,18.14 | v20.73,47.7 v30.63,37.8
  Bottom 0.152: v52.58,10.82 52.58,11.28 45.11,18.75 v44.04,18.75 | v39.78,18.14 39.47,18.14 39.17,18.44 38.25,18.44 37.95,18.14 37.34,18.14 35.97,19.51 33.98,19.51 27.58,25.91 27.58,34.75 v30.63,37.8 | v20.73,47.7 20.73,50.75 17.22,54.25 17.22,62.18 14.63,64.77 U7.RXD
VBUS
  Top 0.203: JP7.1 1.37,1.37 35.2,1.37 38.25,4.42 38.71,4.42 U5.VBUS

### Text on the board
tPlace: Keyglove Kit v0.1 | www.keyglove.net | 1/30/2012 5:25 GMT